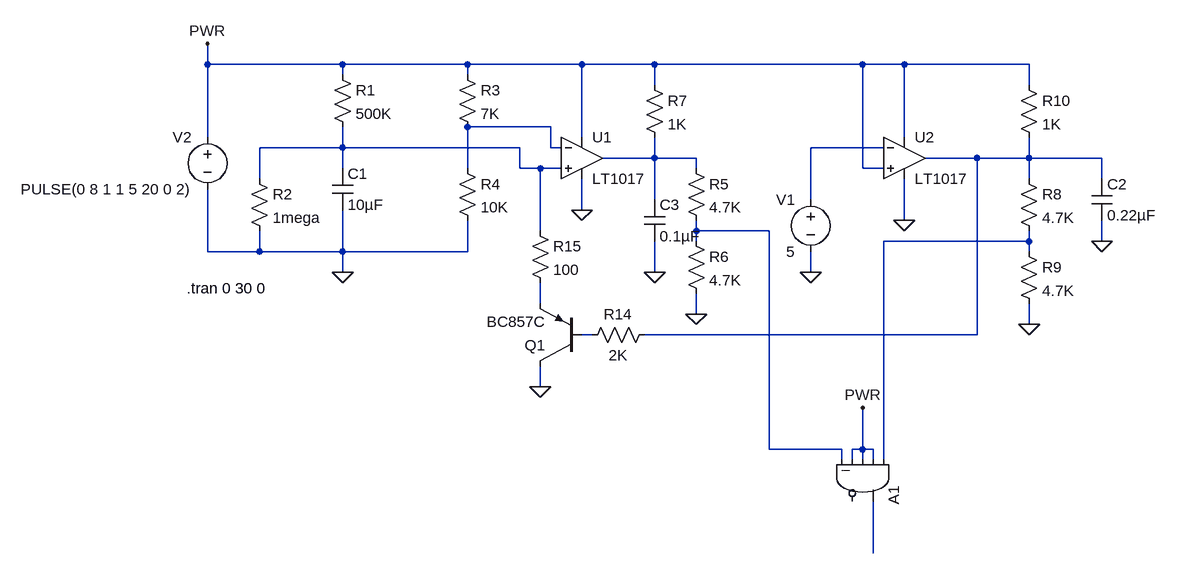
[diagram p0: schematic powerAssertion.asc]
powerAssertion.asc, the LTspice schematic file:
Version 4
SHEET 1 1104 680
WIRE -368 -128 -368 -160
WIRE -160 -128 -368 -128
WIRE 32 -128 -160 -128
WIRE 208 -128 32 -128
WIRE 320 -128 208 -128
WIRE 640 -128 320 -128
WIRE 704 -128 640 -128
WIRE 896 -128 704 -128
WIRE -160 -112 -160 -128
WIRE 32 -112 32 -128
WIRE 320 -96 320 -128
WIRE 896 -96 896 -128
WIRE 160 -32 32 -32
WIRE -368 -16 -368 -128
WIRE 208 -16 208 -128
WIRE 704 -16 704 -128
WIRE -160 0 -160 -32
WIRE -160 0 -288 0
WIRE 112 0 -160 0
WIRE 160 0 160 -32
WIRE 176 0 160 0
WIRE 672 0 560 0
WIRE 320 16 320 -16
WIRE 320 16 240 16
WIRE 384 16 320 16
WIRE 816 16 736 16
WIRE 896 16 896 -16
WIRE 896 16 816 16
WIRE 1008 16 896 16
WIRE -160 32 -160 0
WIRE 32 32 32 -32
WIRE 112 32 112 0
WIRE 144 32 112 32
WIRE 176 32 144 32
WIRE 384 32 384 16
WIRE 640 32 640 -128
WIRE 672 32 640 32
WIRE -288 48 -288 0
WIRE 896 48 896 16
WIRE 1008 48 1008 16
WIRE 320 80 320 16
WIRE 560 80 560 0
WIRE 208 96 208 48
WIRE 704 112 704 48
WIRE 144 128 144 32
WIRE 384 128 384 112
WIRE 496 128 384 128
WIRE 384 144 384 128
WIRE 896 144 896 128
WIRE 896 144 672 144
WIRE 1008 144 1008 112
WIRE -368 160 -368 64
WIRE -288 160 -288 128
WIRE -288 160 -368 160
WIRE -160 160 -160 96
WIRE -160 160 -288 160
WIRE 32 160 32 112
WIRE 32 160 -160 160
WIRE 896 160 896 144
WIRE -160 192 -160 160
WIRE 320 192 320 144
WIRE 560 192 560 160
WIRE 144 240 144 208
WIRE 384 256 384 224
WIRE 896 272 896 240
WIRE 224 288 208 288
WIRE 816 288 816 16
WIRE 816 288 304 288
WIRE 144 368 144 336
WIRE 496 464 496 128
WIRE 608 464 496 464
WIRE 640 464 640 400
WIRE 640 464 624 464
WIRE 656 464 640 464
WIRE 608 480 608 464
WIRE 624 480 624 464
WIRE 640 480 640 464
WIRE 656 480 656 464
WIRE 672 480 672 144
WIRE 656 624 656 544
FLAG -160 192 0
FLAG 208 96 0
FLAG 384 256 0
FLAG 320 192 0
FLAG 704 112 0
FLAG 640 400 PWR
FLAG -368 -160 PWR
FLAG 896 272 0
FLAG 1008 144 0
FLAG 144 368 0
FLAG 560 192 0
SYMBOL res -176 -128 R0
SYMATTR InstName R1
SYMATTR Value 500K
SYMBOL cap -176 32 R0
SYMATTR InstName C1
SYMATTR Value 10µF
SYMBOL res 16 -128 R0
SYMATTR InstName R3
SYMATTR Value 7K
SYMBOL res 16 16 R0
SYMATTR InstName R4
SYMATTR Value 10K
SYMBOL Comparators\\LT1017 208 16 R0
SYMATTR InstName U1
SYMBOL res 368 16 R0
SYMATTR InstName R5
SYMATTR Value 4.7K
SYMBOL res 368 128 R0
SYMATTR InstName R6
SYMATTR Value 4.7K
SYMBOL cap 304 80 R0
SYMATTR InstName C3
SYMATTR Value 0.1µF
SYMBOL res 304 -112 R0
SYMATTR InstName R7
SYMATTR Value 1K
SYMBOL Comparators\\LT1017 704 16 R0
SYMATTR InstName U2
SYMBOL voltage -368 -32 M0
WINDOW 123 0 0 Left 0
WINDOW 39 0 0 Left 0
SYMATTR InstName V2
SYMATTR Value PULSE(0 8 1 1 5 20 0 2)
SYMBOL Digital\\and 704 512 R90
SYMATTR InstName A1
SYMBOL res 880 32 R0
SYMATTR InstName R8
SYMATTR Value 4.7K
SYMBOL res 880 144 R0
SYMATTR InstName R9
SYMATTR Value 4.7K
SYMBOL cap 992 48 R0
SYMATTR InstName C2
SYMATTR Value 0.22µF
SYMBOL res 880 -112 R0
SYMATTR InstName R10
SYMATTR Value 1K
SYMBOL pnp 208 336 R180
SYMATTR InstName Q1
SYMATTR Value BC857C
SYMBOL res 320 272 R90
WINDOW 0 0 56 VBottom 0
WINDOW 3 32 56 VTop 0
SYMATTR InstName R14
SYMATTR Value 2K
SYMBOL res 128 112 R0
SYMATTR InstName R15
SYMATTR Value 100
SYMBOL res -304 32 R0
SYMATTR InstName R2
SYMATTR Value 1mega
SYMBOL voltage 560 64 M0
SYMATTR InstName V1
SYMATTR Value 5
TEXT -400 216 Left 0 !.tran 0 30 0

The netlist it stands for:
* powerAssertion.asc
R1 PWR N002 500K
C1 N002 0 10µF
R3 PWR N001 7K
R4 N001 0 10K
XU1 N002 N001 PWR 0 N004 LT1017  ; pins In+ In- V+ V- OUT
R5 N004 N006 4.7K
R6 N006 0 4.7K
C3 N004 0 0.1µF
R7 PWR N004 1K
XU2 PWR N003 PWR 0 N005 LT1017  ; pins In+ In- V+ V- OUT
V2 PWR 0 PULSE(0 8 1 1 5 20 0 2)
A1 N007 PWR PWR PWR N006 0 N010 0 AND
R8 N005 N007 4.7K
R9 N007 0 4.7K
C2 N005 0 0.22µF
R10 PWR N005 1K
Q1 0 N009 N008 0 BC857C
R14 N005 N009 2K
R15 N002 N008 100
R2 N002 0 1mega
V1 N003 0 5
.model NPN NPN
.model PNP PNP
.lib standard.bjt
.tran 0 30 0
.backanno
.end